# Altium project agm_evb.PrjPCB
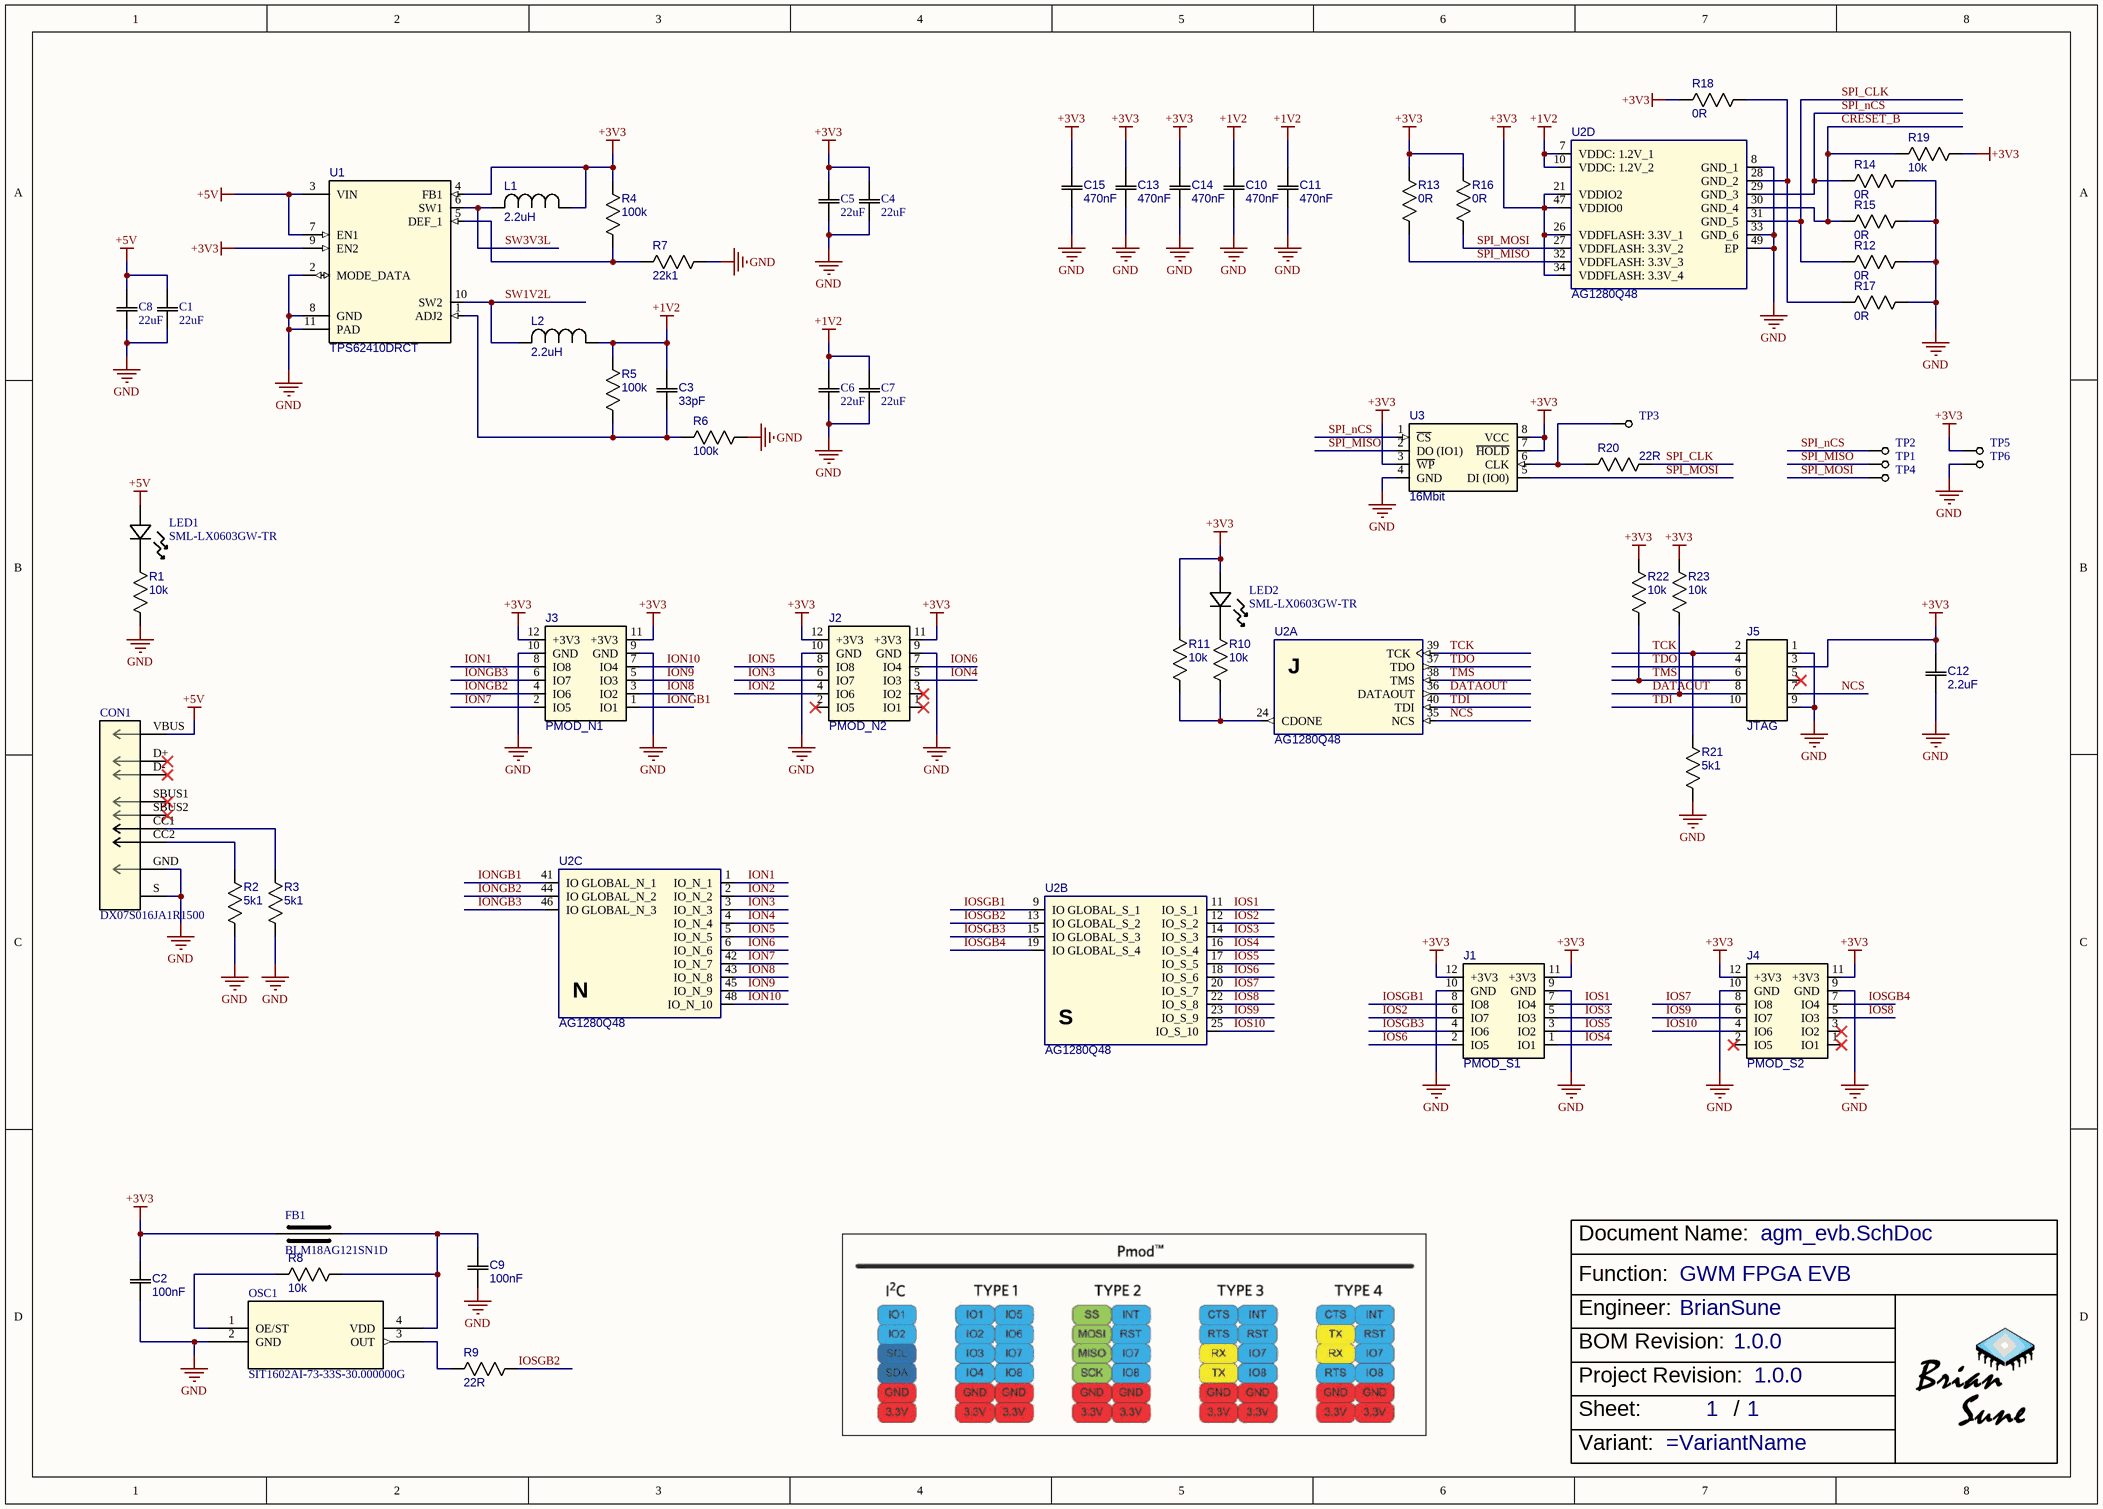
[diagram p0: agm_evb.SchDoc]
BOMRevision: 1.0.0; EngineerName: BrianSune; ProjectRevision: 1.0.0
1 sheet, 60 parts. Net scope: global (net labels, ports and power ports of the same name join across sheets).
Board file: agm_evb.PcbDoc

## Sheet agm_evb.SchDoc
size A3; DocumentNumber: 1; SheetNumber: 1; SheetTotal: 1

### Parts
?  Function: GWM FPGA EVB  (hidden comment: TitleBlock)  (graphical)
C1  22uF  [CAPC220145_145N_KEM]
C2  100nF  [CAP_CC0402_YAG]
C3  33pF  [CAP_CC0402_YAG]
C4  22uF  [CAPC220145_145N_KEM]
C5  22uF  [CAPC220145_145N_KEM]
C6  22uF  [CAPC220145_145N_KEM]
C7  22uF  [CAPC220145_145N_KEM]
C8  22uF  [CAPC220145_145N_KEM]
C9  100nF  [CAP_CC0402_YAG]
C10  470nF  [CAP_CC0402_YAG]
C11  470nF  [CAP_CC0402_YAG]
C12  2.2uF  [CAP_CC0402_YAG]
C13  470nF  [CAP_CC0402_YAG]
C14  470nF  [CAP_CC0402_YAG]
C15  470nF  [CAP_CC0402_YAG]
CON1  DX07S016JA1R1500  [CONN12_016JA1R1500_JAE]
FB1  BLM18AG121SN1D  [IND_BLM18_0603_MUR]
J1  PMOD_S1  [CON12_2X6_P100UM_HDR_TYC]
J2  PMOD_N2  [CON12_2X6_P100UM_HDR_TYC]
J3  PMOD_N1  [CON12_2X6_P100UM_HDR_TYC]
J4  PMOD_S2  [CON12_2X6_P100UM_HDR_TYC]
J5  JTAG  [CONN10_G821_20P32X8P7_AMP]
L1  2.2uH  [1277AS-H-1R0M=P2]
L2  2.2uH  [1277AS-H-1R0M=P2]
LED1  SML-LX0603GW-TR  [LED_SML-LX0603GW-TR_LUM]
LED2  SML-LX0603GW-TR  [LED_SML-LX0603GW-TR_LUM]
OSC1  SIT1602AI-73-33S-30.000000G  [SON4_SIT1602-7_SIT]
R1  10k  [0402_PAN]
R2  5k1  [0402_PAN]
R3  5k1  [0402_PAN]
R4  100k  [0402_PAN]
R5  100k  [0402_PAN]
R6  100k  [0402_PAN]
R7  22k1  [0402_PAN]
R8  10k  [0402_PAN]
R9  22R  [0402_PAN]
R10  10k  [0402_PAN]
R11  10k  [0402_PAN]
R12  0R  [0402_PAN]
R13  0R  [0402_PAN]
R14  0R  [0402_PAN]
R15  0R  [0402_PAN]
R16  0R  [0402_PAN]
R17  0R  [0402_PAN]
R18  0R  [0402_PAN]
R19  10k  [0402_PAN]
R20  22R  [0402_PAN]
R21  5k1  [0402_PAN]
R22  10k  [0402_PAN]
R23  10k  [0402_PAN]
TP1  TP  [2mm_tp]  (value not drawn)
TP2  TP  [2mm_tp]  (value not drawn)
TP3  TP  [2mm_tp]  (value not drawn)
TP4  TP  [2mm_tp]  (value not drawn)
TP5  TP  [2mm_tp]  (value not drawn)
TP6  TP  [2mm_tp]  (value not drawn)
U1  TPS62410DRCT  [DRC0010J]
U2  AG1280Q48  [QFN48_EP]  (parts A,B,C,D of 4)
U3  16Mbit  [SOIC_16JLSSIG_WIN]

### Nets
+1V2: C3.2 C6.2 C7.2 C10.2 C11.2 L2.1 R5.2 U2.7(VDDC:_1.2V_1) U2.10(VDDC:_1.2V_2)
+3V3: C2.2 C4.2 C5.2 C12.2 C13.2 C14.2 C15.2 FB1.2 J1.11(+3V3) J1.12(+3V3) J2.11(+3V3) J2.12(+3V3) J3.11(+3V3) J3.12(+3V3) J4.11(+3V3) J4.12(+3V3) J5.3 L1.1 LED2.2 R4.2 R11.2 R13.1 R16.1 R18.2 R19.2 R22.2 R23.2 TP5.1(TP) U1.4(FB1) U1.9(EN2) U2.21(VDDIO2) U2.26(VDDFLASH:_3.3V_1) U2.34(VDDFLASH:_3.3V_4) U2.47(VDDIO0) U3.3(~{WP}) U3.7(~{HOLD}) U3.8(VCC)
+5V: C1.2 C8.2 CON1.VBUS LED1.2 U1.3(VIN) U1.7(EN1)
GND: C1.1 C2.1 C4.1 C5.1 C6.1 C7.1 C8.1 C9.1 C10.1 C11.1 C12.1 C13.1 C14.1 C15.1 CON1.GND CON1.S(SA) J1.9(GND) J1.10(GND) J2.9(GND) J2.10(GND) J3.9(GND) J3.10(GND) J4.9(GND) J4.10(GND) J5.1 J5.9 OSC1.2(GND) R1.1 R2.1 R3.1 R6.1 R7.1 R12.1 R14.1 R15.1 R17.1 R21.1 TP6.1(TP) U1.2(MODE_DATA) U1.8(GND) U1.11(PAD) U2.8(GND_1) U2.33(GND_6) U2.49(EP) U3.4(GND)
CRESET_B: R15.2 R19.1 U2.30(GND_4)
DATAOUT: J5.8 R23.1 U2.36(DATAOUT)
ION1: J3.8(IO8) U2.1(IO_N_1)
ION2: J2.4(IO6) U2.2(IO_N_2)
ION3: J2.6(IO7) U2.3(IO_N_3)
ION4: J2.5(IO3) U2.4(IO_N_4)
ION5: J2.8(IO8) U2.5(IO_N_5)
ION6: J2.7(IO4) U2.6(IO_N_6)
ION7: J3.2(IO5) U2.42(IO_N_7)
ION8: J3.3(IO2) U2.43(IO_N_8)
ION9: J3.5(IO3) U2.45(IO_N_9)
ION10: J3.7(IO4) U2.48(IO_N_10)
IONGB1: J3.1(IO1) U2.41(IO_GLOBAL_N_1)
IONGB2: J3.4(IO6) U2.44(IO_GLOBAL_N_2)
IONGB3: J3.6(IO7) U2.46(IO_GLOBAL_N_3)
IOS1: J1.7(IO4) U2.11(IO_S_1)
IOS2: J1.6(IO7) U2.12(IO_S_2)
IOS3: J1.5(IO3) U2.14(IO_S_3)
IOS4: J1.1(IO1) U2.16(IO_S_4)
IOS5: J1.3(IO2) U2.17(IO_S_5)
IOS6: J1.2(IO5) U2.18(IO_S_6)
IOS7: J4.8(IO8) U2.20(IO_S_7)
IOS8: J4.5(IO3) U2.22(IO_S_8)
IOS9: J4.6(IO7) U2.23(IO_S_9)
IOS10: J4.4(IO6) U2.25(IO_S_10)
IOSGB1: J1.8(IO8) U2.9(IO_GLOBAL_S_1)
IOSGB2: R9.1 U2.13(IO_GLOBAL_S_2)
IOSGB3: J1.4(IO6) U2.15(IO_GLOBAL_S_3)
IOSGB4: J4.7(IO4) U2.19(IO_GLOBAL_S_4)
NCS: J5.7 U2.35(NCS)
SPI_CLK: R12.2 R20.1 U2.31(GND_5)
SPI_MISO: R13.2 TP1.1(TP) U2.32(VDDFLASH:_3.3V_3) U3.2(DO_(IO1))
SPI_MOSI: R16.2 TP4.1(TP) U2.27(VDDFLASH:_3.3V_2) U3.5(DI_(IO0))
SPI_nCS: R14.2 TP2.1(TP) U2.29(GND_3) U3.1(~{CS})
SW1V2L: L2.2 U1.10(SW2)
SW3V3L: L1.2 U1.6(SW1)
TCK: J5.2 R21.2 U2.39(TCK)
TDI: J5.10 U2.40(TDI)
TDO: J5.4 U2.37(TDO)
TMS: J5.6 R22.1 U2.38(TMS)
NetC3_1: C3.1 R5.1 R6.2 U1.1(ADJ2)
NetC9_2: C9.2 FB1.1 OSC1.4(VDD) R8.1
NetCON1_CC1: CON1.CC1 R3.2
NetCON1_CC2: CON1.CC2 R2.2
NetLED1_1: LED1.1 R1.2
NetLED2_1: LED2.1 R10.2
NetOSC1_1: OSC1.1(OE/ST) R8.2
NetOSC1_3: OSC1.3(OUT) R9.2
NetR4_1: R4.1 R7.2 U1.5(DEF_1)
NetR10_1: R10.1 R11.1 U2.24(CDONE)
NetR17_2: R17.2 R18.1 U2.28(GND_2)
NetR20_2: R20.2 TP3.1(TP) U3.6(CLK)

Not connected (* = marked no-connect by the designer): CON1 D+* D-(D_)* SBUS1* SBUS2*; J2 1(IO1)* 2(IO5)* 3(IO2)*; J4 1(IO1)* 2(IO5)* 3(IO2)*; J5 5*

### Notes on the sheet
- (in symbol AG1280Q48, part A) J
- (in symbol AG1280Q48, part B) S
- (in symbol AG1280Q48, part C) N
- (in symbol TitleBlock) Document Name:; Function:; Engineer:; BOM Revision:; Project Revision:; Sheet:; /; Variant:

### Library data of the parts
C1 C4-C8 = C0805C106M9RACTU: No Description Available; Mfr_Name: Kemet; Type: DEV; Copyright: Copyright (C) 2022 Ultra Librarian. All rights reserved.; Manufacturer_Part_Number: C0805C106M9RACTU; RefDes: RefDes
C2 C9 = GCM155R71H104ME02J: GCM155R71H104ME02J / Multilayer Ceramic Capacitors MLCC - SMD/SMT; Mfr.: Murata Electronics; ComponentLink1Description: mouser; ComponentLink1URL: https://www.mouser.hk/ProductDetail/Murata-Electronics/GCM155R71H104ME02J?qs=QzBtWTOodeX25ZLBhHkqFQ%3D%3D; Mfr. No: GCM155R71H104ME02J
C3 = GCM1555C1H330JA16J: Mfr.: Murata Electronics; ComponentLink1Description: mouser; ComponentLink1URL: https://www.mouser.hk/ProductDetail/Murata-Electronics/GCM1555C1H330JA16J?qs=hNud%2FORuBR35r9xfgxU5AA%3D%3D; Mfr. No: GCM1555C1H330JA16J
C10 C11 C13-C15 = GRM155R71A474KE01D: GRM155R71A474KE01D / Multilayer Ceramic Capacitors MLCC - SMD/SMT PLEASE SEE MURATA'S SUGGESTED ALTERNATE GRM155R61H474ME11D; Mfr. No: GRM155R6YA474ME01D; Mfr.: Murata Electronics; ComponentLink1Description: mouser; ComponentLink1URL: https://www.mouser.hk/ProductDetail/Murata-Electronics/GRM155R6YA474ME01D?qs=sGAEpiMZZMsh%252B1woXyUXj0ipSi1CtQgVFCJAGxNeTMI%3D
C12 = GRM155R6YA225ME11D: GRM155R6YA225ME11D / Multilayer Ceramic Capacitors MLCC - SMD/SMT 2.2UF 35V 20% 0402; Mfr.: Murata Electronics; ComponentLink1Description: mouser; ComponentLink1URL: https://www.mouser.hk/ProductDetail/Murata-Electronics/GRM155R6YA225ME11D?qs=84nSAGdh8NX%252BZ1uZ5doDKg%3D%3D; Mfr. No: GRM155R6YA225ME11D
CON1 = DX07S016JA1R1500: No Description Available; Built_By: EMA_Matt; Vendor: JAE Electronics; SourceLibrary: JAE_Electronics_2020-03-30; Datasheet: https://www.digikey.com/product-detail/en/DX07S016JA1R1500/670-DX07S016JA1R1500CT-ND/11586676?utm_campaign=buynow&WT.z_cid=ref_octopart_dkc_buynow&utm_medium=aggregator&curr=usd&site=us&utm_source=octopart; Manufacturer_Part_Number: DX07S016JA1R1500; Copyright: Copyright (C) 2018 Accelerated Designs. All rights reserved; RefDes: RefDes; Type: DEV
FB1 = BLM18AG121SN1D: No Description Available; Mfr_Name: Murata; Type: DEV; Copyright: Copyright (C) 2022 Ultra Librarian. All rights reserved.; Manufacturer_Part_Number: BLM18AG121SN1D; RefDes: RefDes
J1-J4 = 10129381-912001BLF: 10129381-912001BLF / Headers & Wire Housings ECONOSTIK HEADER DR VT TH 2X6; Mfr. No: 826942-6; Mfr.: 10129381-912001BLF; ComponentLink1Description: mouser; ComponentLink1URL: https://www.mouser.hk/ProductDetail/Amphenol-FCI/10129381-912001BLF?qs=0lQeLiL1qybH5JyuikDxjQ%3D%3D
J5 = G821EU210AGM00Y: G821EU210AGM00Y / Headers & Wire Housings Box Header 2.54mm*2.54mm Pitch STR DIP, 2x5Pin, G/F, NY6T, TAIL=3.0mm, Color-Black, T&R, WO/CAP; Mfr.: Amphenol ICC; Mfr. No: G821EU210AGM00Y; ComponentLink1Description: mouser; ComponentLink1URL: https://www.mouser.hk/ProductDetail/Amphenol-Commercial-Products/G821EU210AGL00RS?qs=PzGy0jfpSMsw%252Bc01gC9TMg%3D%3D
L1 L2 = 1277AS-H-2R2M=P2: 1277AS-H-2R2M=P2 / SMD 2.2 UH 20%; Mfr_Name: Murata; Manufacturer_Part_Number: 1277AS-H-2R2M=P2; ComponentLink1Description: mouser; ComponentLink1URL: https://www.mouser.hk/ProductDetail/Murata-Electronics/1277AS-H-2R2M%3DP2?qs=4tuKoHGzn104DGWhEjLPYA%3D%3D
LED1 LED2 = SML-LX0603GW-TR: No Description Available; Vendor: Lumex; Built_By: EMA_Cory; SourceLibrary: Lumex_2020-09-08; Type: DEV; Datasheet: https://www.lumex.com/spec/SML-LX0603GW-TR.pdf; Manufacturer_Part_Number: SML-LX0603GW-TR; Copyright: Copyright (C) 2018 Accelerated Designs. All rights reserved; RefDes: RefDes
OSC1 = SIT1602AI-73-33S-30.000000G: No Description Available; Built_By: EMA_Justin; Vendor: SiTime; SourceLibrary: SiTime_2019-03-28_19; Copyright: Copyright (C) 2018 Accelerated Designs. All rights reserved; Manufacturer_Part_Number: SIT1602AI-73-33S-30.000000G; RefDes: RefDes; Type: DEV
R1 R8 R10 R11 R19 R22 R23 = RT0402FRE0710KL: RT0402FRE0710KL / SMD 1/16W 10K ohm 1% 50ppm; Mfr.: YAGEO; ComponentLink1Description: mouser; ComponentLink1URL: https://www.mouser.hk/ProductDetail/YAGEO/RT0402FRE0710KL?qs=BXCcY9r%252B08Amup7nMFKW1g%3D%3D; Mfr. No: RT0402FRE0710KL
R2 R3 R21 = RT0402FRE075K1L: RT0402FRE075K1L / Thin Film Resistors - SMD 5.1K OHM 1% 50PPM 1/16W; Mfr.: YAGEO; ComponentLink1Description: mouser; ComponentLink1URL: https://www.mouser.hk/ProductDetail/YAGEO/RT0402FRE075K1L?qs=gY0y7AQI9SP4FZkrbB0g%252BA%3D%3D; Mfr. No: RT0402FRE075K1L
R4-R6 = RT0402FRE07100KL: RT0402FRE07100KL / SMD 1/16W 100K ohm 1% 50ppm; Mfr.: YAGEO; ComponentLink1Description: mouser; ComponentLink1URL: https://www.mouser.hk/ProductDetail/YAGEO/RT0402FRE07100KL?qs=BXCcY9r%252B08CxTvf5JB1kiw%3D%3D; Mfr. No: RT0402FRE07100KL
R7 = RT0402FRE0722K1L: RT0402FRE0722K1L / SMD 1/16W 22.1K ohm 1% 50ppm; Mfr.: YAGEO; ComponentLink1Description: mouser; ComponentLink1URL: https://www.mouser.hk/ProductDetail/YAGEO/RT0402FRE0722K1L?qs=gY0y7AQI9SNvNyhDoNY8tg%3D%3D; Mfr. No: RT0402FRE0722K1L
R9 R20 = RT0402FRE0722RL: RT0402FRE0722RL / SMD 1/16W 22 ohm 1% 50ppm; Mfr.: YAGEO; ComponentLink1Description: mouser; ComponentLink1URL: https://www.mouser.hk/ProductDetail/YAGEO/RT0402FRE0722RL?qs=BXCcY9r%252B08AR6tDwkCsBaQ%3D%3D; Mfr. No: RT0402FRE0722RL
R12-R18 = RC0402FR-070RL: RC0402FR-070RL / Thick Film Resistors - SMD 0 Ohms 62.5mW 0402 1%; Mfr.: YAGEO; ComponentLink1Description: mouser; ComponentLink1URL: https://www.mouser.hk/ProductDetail/YAGEO/RC0402FR-070RL?qs=sxZXDnvRBEhfSy4CZGX2ww%3D%3D; Mfr. No: RC0402FR-070RL
U1 = TPS62410DRCT: TPS62410DRCT / 2.25MHZ 2x800mA Dual Step-Down; Mfr_Name: Texas Instruments; Manufacturer_Part_Number: TPS62410DRCT; ComponentLink1Description: mouser; ComponentLink1URL: https://www.mouser.hk/ProductDetail/Texas-Instruments/TPS62410DRCR?qs=e2UXF4UEWQ0ltUOqd4EYmg%3D%3D
U2 = AG1280Q48: AG1280Q48 / Replacement EPM1270; Mfr.: AGM; ComponentLink1Description: taobao; ComponentLink1URL: https://item.taobao.com/item.htm?spm=a1z10.3-c-s.w4002-24461620540.9.b1725d4eQU1zMx&id=661396416086; Mfr. No: AG1280Q48
U3 = W25Q16JLSSIG: W25Q16JLSSIG / NOR Flash spiFlash, 16M-bit, 4Kb Uniform Sector; Mfr.: Winbond; Mfr. No: W25Q16JLSSIG; ComponentLink1Description: mouser; ComponentLink1URL: https://www.mouser.hk/ProductDetail/Winbond/W25Q16JLSSIG?qs=qSfuJ%252Bfl%2Fd6Xi57nHYg5gQ%3D%3D

## Assembly variants
AG1KLPQ48: not fitted R15 R16 R17 R18 R19 R23 TP1 TP2 TP3 TP4 TP5 TP6
AG1280Q48: not fitted R20 R22 TP1 TP2 TP3 TP4 TP5 TP6